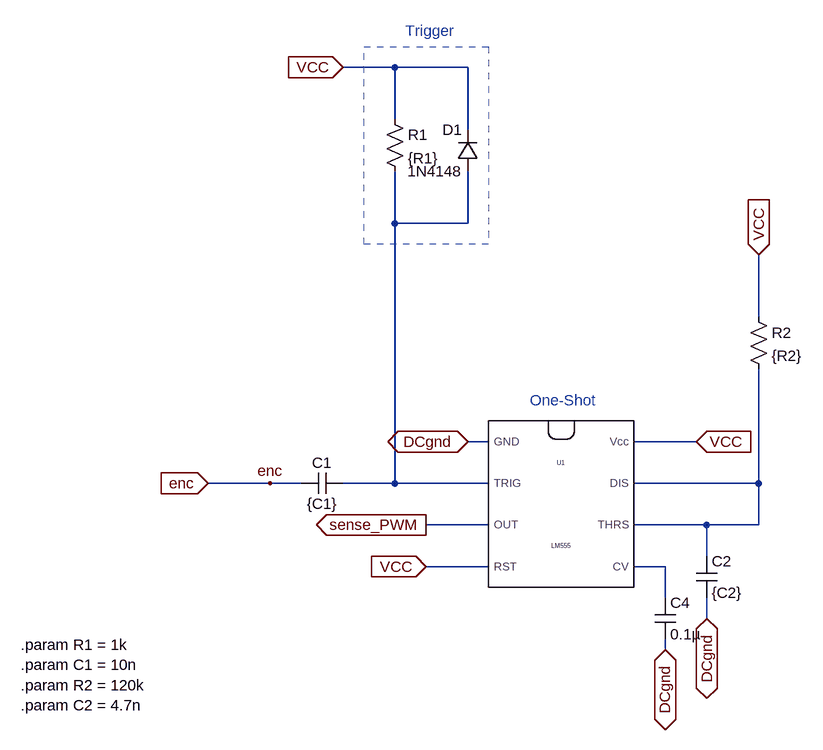
[diagram p0: schematic tach.asc]
tach.asc, the LTspice schematic file:
Version 4
SHEET 1 1188 692
WIRE 512 -480 432 -480
WIRE 624 -480 512 -480
WIRE 512 -400 512 -480
WIRE 624 -384 624 -480
WIRE 512 -240 512 -320
WIRE 624 -240 624 -320
WIRE 624 -240 512 -240
WIRE 1072 -96 1072 -192
WIRE 656 96 624 96
WIRE 976 96 880 96
WIRE 320 160 224 160
WIRE 368 160 320 160
WIRE 512 160 512 -240
WIRE 512 160 432 160
WIRE 656 160 512 160
WIRE 1072 160 1072 -16
WIRE 1072 160 880 160
WIRE 656 224 560 224
WIRE 992 224 880 224
WIRE 1072 224 1072 160
WIRE 1072 224 992 224
WIRE 992 272 992 224
WIRE 656 288 560 288
WIRE 928 288 880 288
WIRE 928 336 928 288
WIRE 992 368 992 336
WIRE 928 416 928 400
FLAG 320 160 enc
FLAG 560 288 VCC
IOPIN 560 288 In
FLAG 560 224 sense_PWM
IOPIN 560 224 Out
FLAG 976 96 VCC
IOPIN 976 96 In
FLAG 432 -480 VCC
IOPIN 432 -480 In
FLAG 1072 -192 VCC
IOPIN 1072 -192 In
FLAG 224 160 enc
IOPIN 224 160 In
FLAG 992 368 DCgnd
IOPIN 992 368 BiDir
FLAG 928 416 DCgnd
IOPIN 928 416 BiDir
FLAG 624 96 DCgnd
IOPIN 624 96 BiDir
SYMBOL cap 432 144 R90
WINDOW 0 0 32 VBottom 2
WINDOW 3 32 32 VTop 2
SYMATTR InstName C1
SYMATTR Value {C1}
SYMBOL res 496 -416 R0
SYMATTR InstName R1
SYMATTR Value {R1}
SYMBOL diode 640 -320 R180
WINDOW 0 24 64 Left 2
WINDOW 3 24 0 Left 2
SYMATTR InstName D1
SYMATTR Value 1N4148
SYMBOL LM555 768 192 R0
SYMATTR InstName U1
SYMBOL cap 912 336 R0
SYMATTR InstName C4
SYMATTR Value 0.1µ
SYMBOL cap 976 272 R0
SYMATTR InstName C2
SYMATTR Value {C2}
SYMBOL res 1056 -112 R0
SYMATTR InstName R2
SYMATTR Value {R2}
TEXT 528 -536 Left 2 ;Trigger
TEXT 720 32 Left 2 ;One-Shot
TEXT -64 408 Left 2 !.param R1 = 1k\n.param C1 = 10n\n.param R2 = 120k\n.param C2 = 4.7n
RECTANGLE Normal 656 -208 464 -512 2

The netlist it stands for:
* tach.asc
C1 N001 enc {C1}
R1 VCC N001 {R1}
D1 N001 VCC 1N4148
XU1 DCgnd N001 sense_PWM VCC N003 N002 N002 VCC NE555  ; pins GND TRIG OUT RST CV THRS DIS Vcc
C4 N003 DCgnd 0.1µ
C2 N002 DCgnd {C2}
R2 VCC N002 {R2}
.model D D
.lib standard.dio
* Trigger
* One-Shot
.param R1 = 1k
.param C1 = 10n
.param R2 = 120k
.param C2 = 4.7n
.lib NE555.sub
.backanno
.end